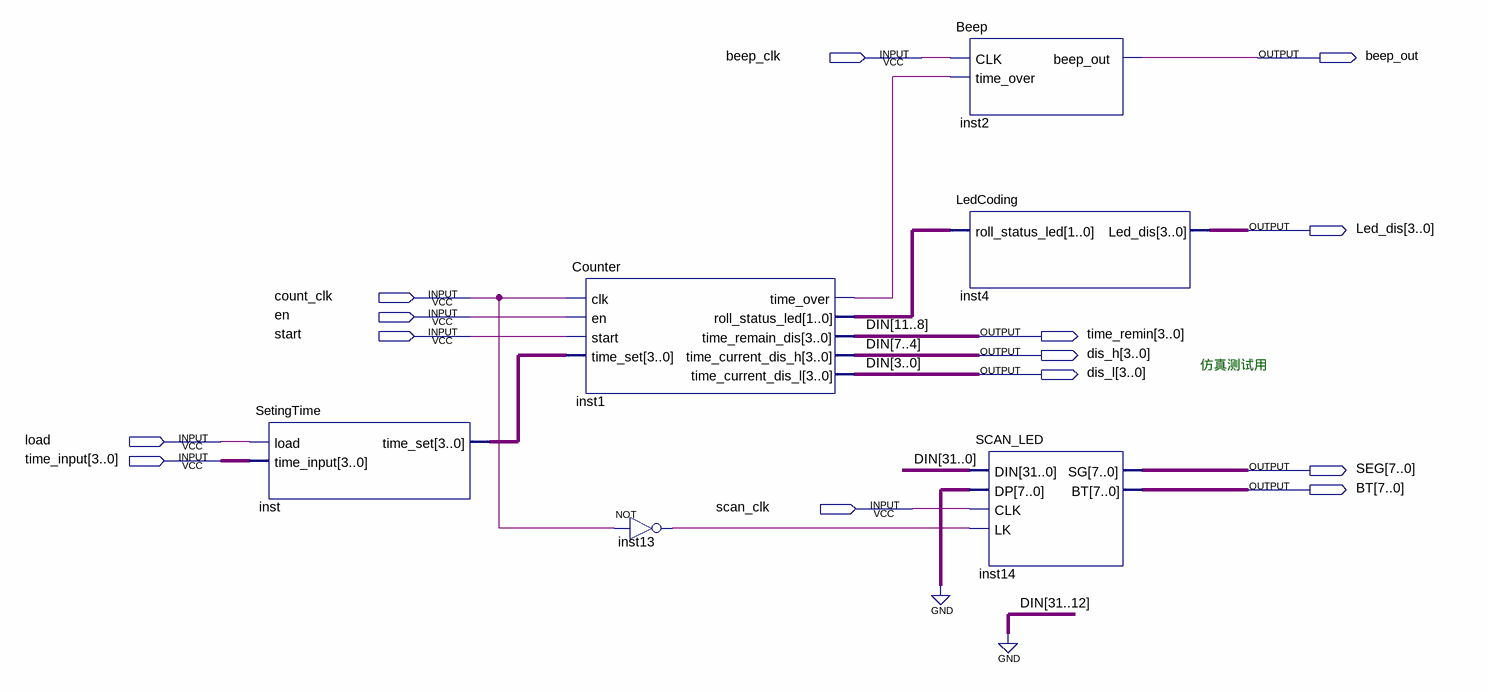
[diagram p0: schematic sheet]
// Quartus schematic top.bdf as structural Verilog: 6 symbols, 14 pins
module top (
  input  beep_clk,
  input  count_clk,
  input  en,
  input  start,
  input  load,
  input  [3:0] time_input,
  input  scan_clk,
  output beep_out,
  output [3:0] Led_dis,
  output [3:0] time_remin,
  output [3:0] dis_h,
  output [3:0] dis_l,
  output [7:0] SEG,
  output [7:0] BT
);

  wire inst1_time_over, inst13_out;
  wire [1:0] inst1_roll_status_led;
  wire [3:0] inst_time_set;

  SetingTime inst (.load(load), .time_input(time_input), .time_set(inst_time_set));
  Counter inst1 (
    .clk(count_clk), .en(en), .start(start), .time_set(inst_time_set), .time_over(inst1_time_over),
    .roll_status_led(inst1_roll_status_led), .time_remain_dis(time_remin), .time_current_dis_h(dis_h),
    .time_current_dis_l(dis_l));
  not inst13 (inst13_out, count_clk);
  Beep inst2 (.CLK(beep_clk), .time_over(inst1_time_over), .beep_out(beep_out));
  LedCoding inst4 (.roll_status_led(inst1_roll_status_led), .Led_dis(Led_dis));
  SCAN_LED inst14 (
    .DIN({{20{1'b0}}, time_remin, dis_h, dis_l}), .DP({8{1'b0}}), .CLK(scan_clk), .LK(inst13_out), .SG(SEG),
    .BT(BT));

  // Other names for the same wires on the sheet: DIN[11:0] = {time_remin, dis_h, dis_l}

  // Notes on the sheet:
  //   仿真测试用
endmodule
